# EAGLE design brushless (EAGLE 6.1)

## Sheet 1 of 4
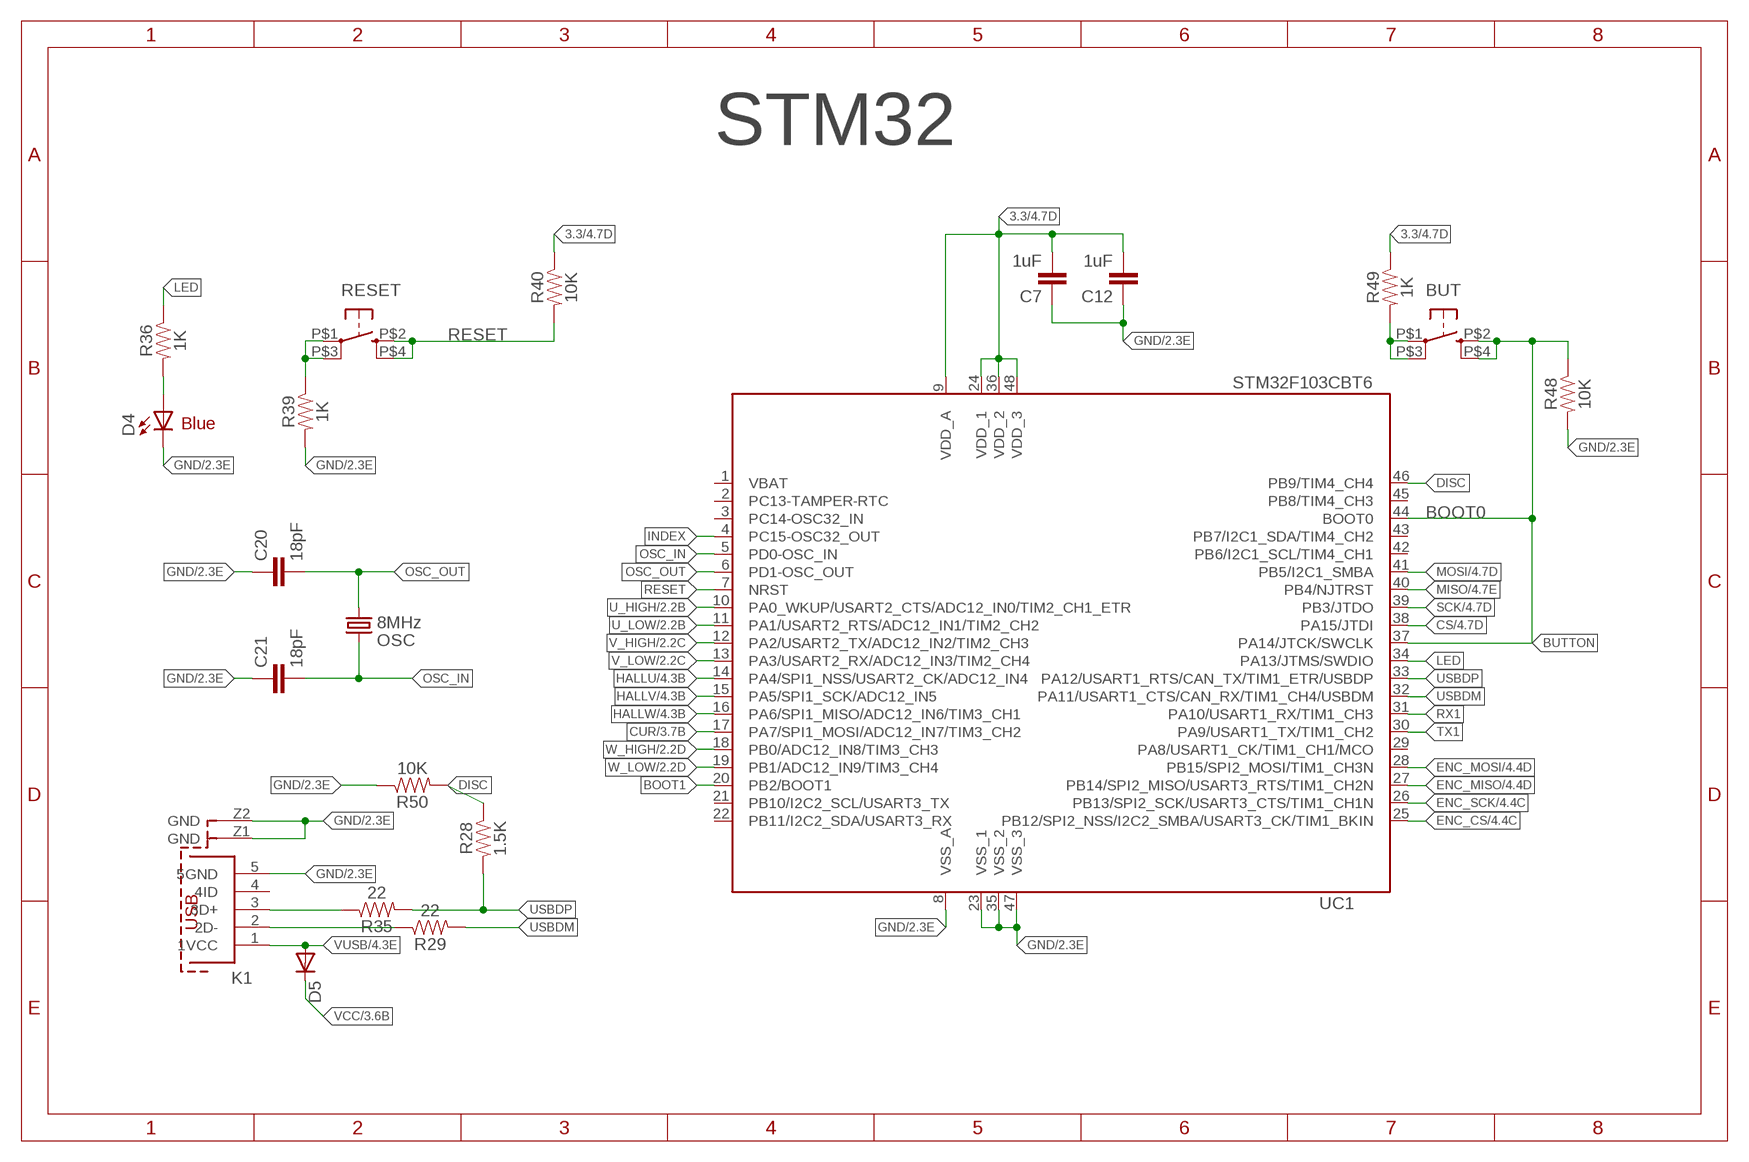
[diagram p0: schematic, sheet 1]

### Parts
BUT  KMR211GLFS  BUTTON-KMR241GLFS  [PUSHBUTTON-KMR241GLFS]
C7  1uF  CAP0805  [0805@1]
C12  1uF  CAP0805  [0805@1]
C20  18pF  CAP0805  [0805@1]
C21  18pF  CAP0805  [0805@1]
D4  Blue  LED1206  [LED-1206]
D5  DIODESOD  [SOD-323]
K1  614105150721  [614105150721]
OSC  8MHz  CRYSTAL5X3  [CRYSTAL-SMD-5X3]
R28  1.5K  RESISTOR0805  [0805]
R29  22  RESISTOR0805  [0805]
R35  22  RESISTOR0805  [0805]
R36  1K  RESISTOR0805  [0805]
R39  1K  RESISTOR0805  [0805]
R40  10K  RESISTOR0805  [0805]
R48  10K  RESISTOR0805  [0805]
R49  1K  RESISTOR0805  [0805]
R50  10K  RESISTOR0805  [0805]
RESET  KMR211GLFS  BUTTON-KMR241GLFS  [PUSHBUTTON-KMR241GLFS]
UC1  STM32F103CBT6  STM32_STM32F103CB  [STM32_LQFP48]

### Nets
3.3: C7.2 C12.2 R40.1 R49.1 UC1.9(VDD_A) UC1.24(VDD_1) UC1.36(VDD_2) UC1.48(VDD_3) ; also sheet 4
BOOT1: UC1.20(PB2/BOOT1)
BUTTON: BUT.P$2 BUT.P$4 R48.1 UC1.37(PA14/JTCK/SWCLK) UC1.44(BOOT0)
CS: UC1.38(PA15/JTDI) ; also sheet 4
CUR: UC1.17(PA7/SPI1_MOSI/ADC12_IN7/TIM3_CH2) ; also sheet 3
DISC: R28.1 R50.2 UC1.46(PB9/TIM4_CH4)
ENC_CS: UC1.25(PB12/SPI2_NSS/I2C2_SMBA/USART3_CK/TIM1_BKIN) ; also sheet 4
ENC_MISO: UC1.27(PB14/SPI2_MISO/USART3_RTS/TIM1_CH2N) ; also sheet 4
ENC_MOSI: UC1.28(PB15/SPI2_MOSI/TIM1_CH3N) ; also sheet 4
ENC_SCK: UC1.26(PB13/SPI2_SCK/USART3_CTS/TIM1_CH1N) ; also sheet 4
GND [power]: C7.1 C12.1 C20.1 C21.1 D4.C K1.5(5GND) K1.Z1(GND) K1.Z2(GND) R39.2 R48.2 R50.1 UC1.8(VSS_A) UC1.23(VSS_1) UC1.35(VSS_2) UC1.47(VSS_3) ; also sheet 2,3,4
HALLU: UC1.14(PA4/SPI1_NSS/USART2_CK/ADC12_IN4) ; also sheet 4
HALLV: UC1.15(PA5/SPI1_SCK/ADC12_IN5) ; also sheet 4
HALLW: UC1.16(PA6/SPI1_MISO/ADC12_IN6/TIM3_CH1) ; also sheet 4
INDEX: UC1.4(PC15-OSC32_OUT)
LED: R36.1 UC1.34(PA13/JTMS/SWDIO)
MISO: UC1.40(PB4/NJTRST) ; also sheet 4
MOSI: UC1.41(PB5/I2C1_SMBA) ; also sheet 4
N$19: R39.1 RESET.P$1 RESET.P$3
N$26: BUT.P$1 BUT.P$3 R49.2
N$29: D4.A R36.2
N$59: K1.2(2D-) R29.1
N$60: K1.3(3D+) R35.1
OSC_IN: C21.2 OSC.3 UC1.5(PD0-OSC_IN)
OSC_OUT: C20.2 OSC.1 UC1.6(PD1-OSC_OUT)
RESET: R40.2 RESET.P$2 RESET.P$4 UC1.7(NRST)
RX1: UC1.31(PA10/USART1_RX/TIM1_CH3)
SCK: UC1.39(PB3/JTDO) ; also sheet 4
TX1: UC1.30(PA9/USART1_TX/TIM1_CH2)
U_HIGH: UC1.10(PA0_WKUP/USART2_CTS/ADC12_IN0/TIM2_CH1_ETR) ; also sheet 2
U_LOW: UC1.11(PA1/USART2_RTS/ADC12_IN1/TIM2_CH2) ; also sheet 2
USBDM: R29.2 UC1.32(PA11/USART1_CTS/CAN_RX/TIM1_CH4/USBDM)
USBDP: R28.2 R35.2 UC1.33(PA12/USART1_RTS/CAN_TX/TIM1_ETR/USBDP)
V_HIGH: UC1.12(PA2/USART2_TX/ADC12_IN2/TIM2_CH3) ; also sheet 2
V_LOW: UC1.13(PA3/USART2_RX/ADC12_IN3/TIM2_CH4) ; also sheet 2
VCC: D5.1(C) ; also sheet 3,4
VUSB: D5.2(A) K1.1(1VCC) ; also sheet 4
W_HIGH: UC1.18(PB0/ADC12_IN8/TIM3_CH3) ; also sheet 2
W_LOW: UC1.19(PB1/ADC12_IN9/TIM3_CH4) ; also sheet 2
Unconnected: K1.4(4ID) UC1.2(PC13-TAMPER-RTC) UC1.3(PC14-OSC32_IN) UC1.21(PB10/I2C2_SCL/USART3_TX) UC1.22(PB11/I2C2_SDA/USART3_RX) UC1.29(PA8/USART1_CK/TIM1_CH1/MCO) UC1.42(PB6/I2C1_SCL/TIM4_CH1) UC1.43(PB7/I2C1_SDA/TIM4_CH2) UC1.45(PB8/TIM4_CH3)

### Notes on the sheet
- STM32
- Blue
- BOOT0

## Sheet 2 of 4
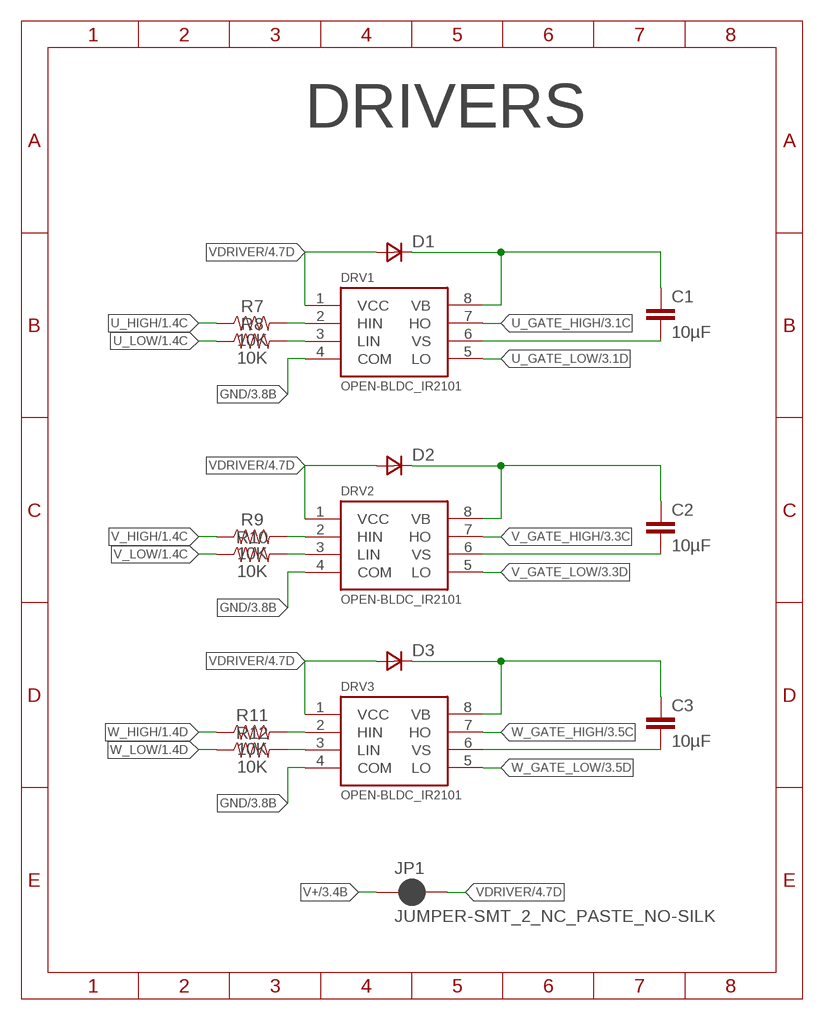
[diagram p1: schematic, sheet 2]

### Parts
C1  10µF  0.33UF/330NF-0805-50V-10%  [0805]
C2  10µF  0.33UF/330NF-0805-50V-10%  [0805]
C3  10µF  0.33UF/330NF-0805-50V-10%  [0805]
D1  ZETEX_VAR2SOT23  [ZETEX_SOT-23]
D2  ZETEX_VAR2SOT23  [ZETEX_SOT-23]
D3  ZETEX_VAR2SOT23  [ZETEX_SOT-23]
DRV1  OPEN-BLDC_IR2101  [OPEN-BLDC_SO-8]
DRV2  OPEN-BLDC_IR2101  [OPEN-BLDC_SO-8]
DRV3  OPEN-BLDC_IR2101  [OPEN-BLDC_SO-8]
JP1  JUMPER-SMT_2_NC_PASTE_NO-SILK  [SMT-JUMPER_2_NC_PASTE_NO-SILK]
R7  10K  RESISTOR0805  [0805]
R8  10K  RESISTOR0805  [0805]
R9  10K  RESISTOR0805  [0805]
R10  10K  RESISTOR0805  [0805]
R11  10K  RESISTOR0805  [0805]
R12  10K  RESISTOR0805  [0805]

### Nets
GND [power]: DRV1.4(COM) DRV2.4(COM) DRV3.4(COM) ; also sheet 1,3,4
N$4: DRV1.2(HIN) R7.2
N$5: C1.1 D1.1(C) DRV1.8(VB)
N$8: DRV1.3(LIN) R8.2
N$10: C2.1 D2.1(C) DRV2.8(VB)
N$11: C1.2 DRV1.6(VS)
N$12: DRV2.2(HIN) R9.2
N$13: DRV2.3(LIN) R10.2
N$14: C2.2 DRV2.6(VS)
N$15: C3.1 D3.1(C) DRV3.8(VB)
N$16: DRV3.2(HIN) R11.2
N$17: DRV3.3(LIN) R12.2
N$18: C3.2 DRV3.6(VS)
U_GATE_HIGH: DRV1.7(HO) ; also sheet 3
U_GATE_LOW: DRV1.5(LO) ; also sheet 3
U_HIGH: R7.1 ; also sheet 1
U_LOW: R8.1 ; also sheet 1
V+ [vdriver]: JP1.1 ; also sheet 3,4
V_GATE_HIGH: DRV2.7(HO) ; also sheet 3
V_GATE_LOW: DRV2.5(LO) ; also sheet 3
V_HIGH: R9.1 ; also sheet 1
V_LOW: R10.1 ; also sheet 1
VDRIVER [vdriver]: D1.3(A) D2.3(A) D3.3(A) DRV1.1(VCC) DRV2.1(VCC) DRV3.1(VCC) JP1.2 ; also sheet 4
W_GATE_HIGH: DRV3.7(HO) ; also sheet 3
W_GATE_LOW: DRV3.5(LO) ; also sheet 3
W_HIGH: R11.1 ; also sheet 1
W_LOW: R12.1 ; also sheet 1

### Notes on the sheet
- DRIVERS

## Sheet 3 of 4
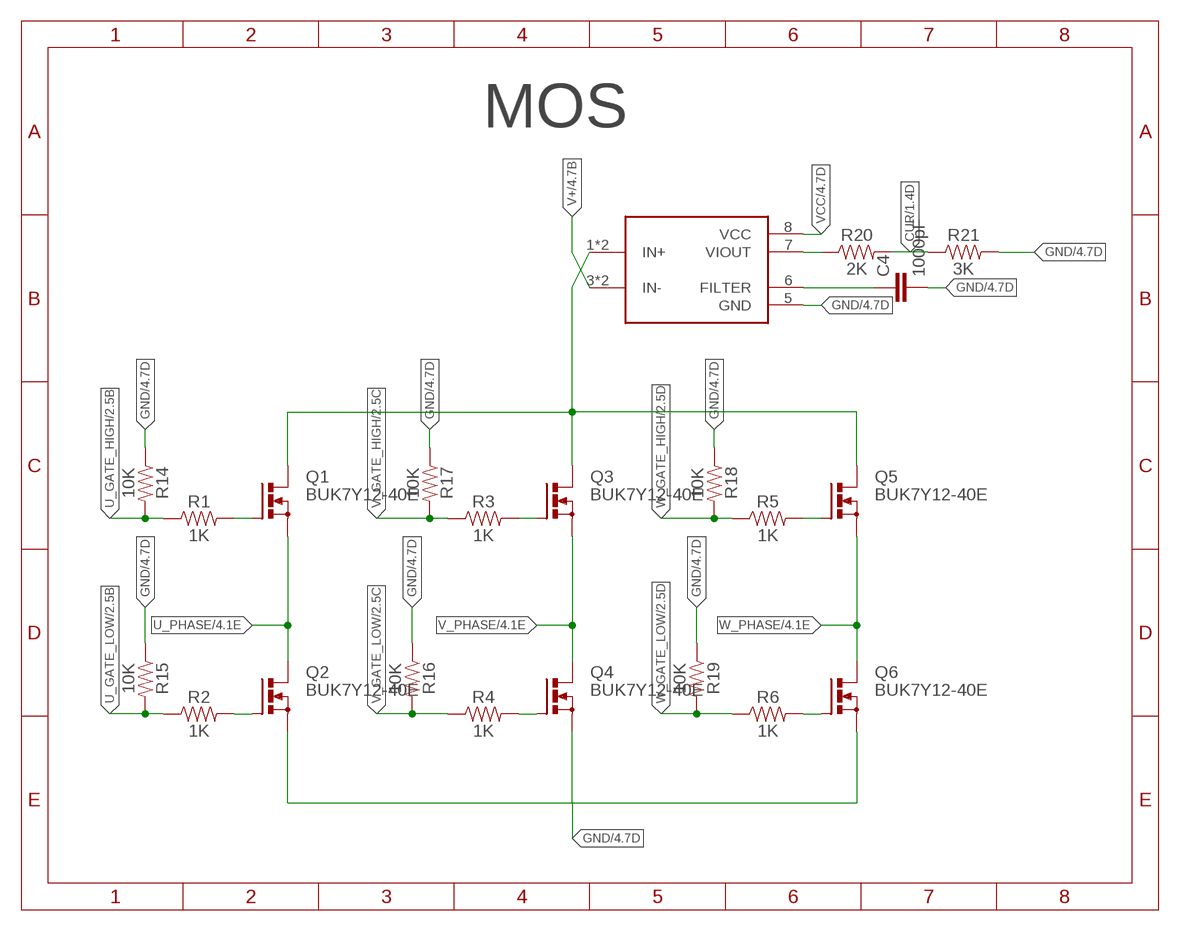
[diagram p2: schematic, sheet 3]

### Parts
C4  1000pF  CAP0805  [0805@1]
Q1  BUK7Y12-40E  [SOT669]
Q2  BUK7Y12-40E  [SOT669]
Q3  BUK7Y12-40E  [SOT669]
Q4  BUK7Y12-40E  [SOT669]
Q5  BUK7Y12-40E  [SOT669]
Q6  BUK7Y12-40E  [SOT669]
R1  1K  RESISTOR0805  [0805]
R2  1K  RESISTOR0805  [0805]
R3  1K  RESISTOR0805  [0805]
R4  1K  RESISTOR0805  [0805]
R5  1K  RESISTOR0805  [0805]
R6  1K  RESISTOR0805  [0805]
R14  10K  RESISTOR0805  [0805]
R15  10K  RESISTOR0805  [0805]
R16  10K  RESISTOR0805  [0805]
R17  10K  RESISTOR0805  [0805]
R18  10K  RESISTOR0805  [0805]
R19  10K  RESISTOR0805  [0805]
R20  2K  RESISTOR0805  [0805]
R21  3K  RESISTOR0805  [0805]
SENSE  ACS712  [SO8]

### Nets
CUR: R20.2 R21.1 ; also sheet 1
GND [power]: C4.2 Q2.1(S) Q2.2(S) Q2.3(S) Q4.1(S) Q4.2(S) Q4.3(S) Q6.1(S) Q6.2(S) Q6.3(S) R14.1 R15.1 R16.1 R17.1 R18.1 R19.1 R21.2 SENSE.5(GND) ; also sheet 1,2,4
N$1: Q1.4(G) R1.2
N$2: Q3.4(G) R3.2
N$3: Q2.4(G) R2.2
N$6: Q4.4(G) R4.2
N$7: Q5.4(G) R5.2
N$9: Q6.4(G) R6.2
N$24: R20.1 SENSE.7(VIOUT)
N$27: C4.1 SENSE.6(FILTER)
U_GATE_HIGH: R1.1 R14.2 ; also sheet 2
U_GATE_LOW: R2.1 R15.2 ; also sheet 2
U_PHASE [power]: Q1.1(S) Q1.2(S) Q1.3(S) Q2.MB(D) ; also sheet 4
V+ [vdriver]: SENSE.3(IN-) SENSE.4(IN-) ; also sheet 2,4
V+_MOS [power]: Q1.MB(D) Q3.MB(D) Q5.MB(D) SENSE.1(IN+) SENSE.2(IN+)
V_GATE_HIGH: R3.1 R17.2 ; also sheet 2
V_GATE_LOW: R4.1 R16.2 ; also sheet 2
V_PHASE [power]: Q3.1(S) Q3.2(S) Q3.3(S) Q4.MB(D) ; also sheet 4
VCC: SENSE.8(VCC) ; also sheet 1,4
W_GATE_HIGH: R5.1 R18.2 ; also sheet 2
W_GATE_LOW: R6.1 R19.2 ; also sheet 2
W_PHASE [power]: Q5.1(S) Q5.2(S) Q5.3(S) Q6.MB(D) ; also sheet 4

### Notes on the sheet
- MOS

## Sheet 4 of 4
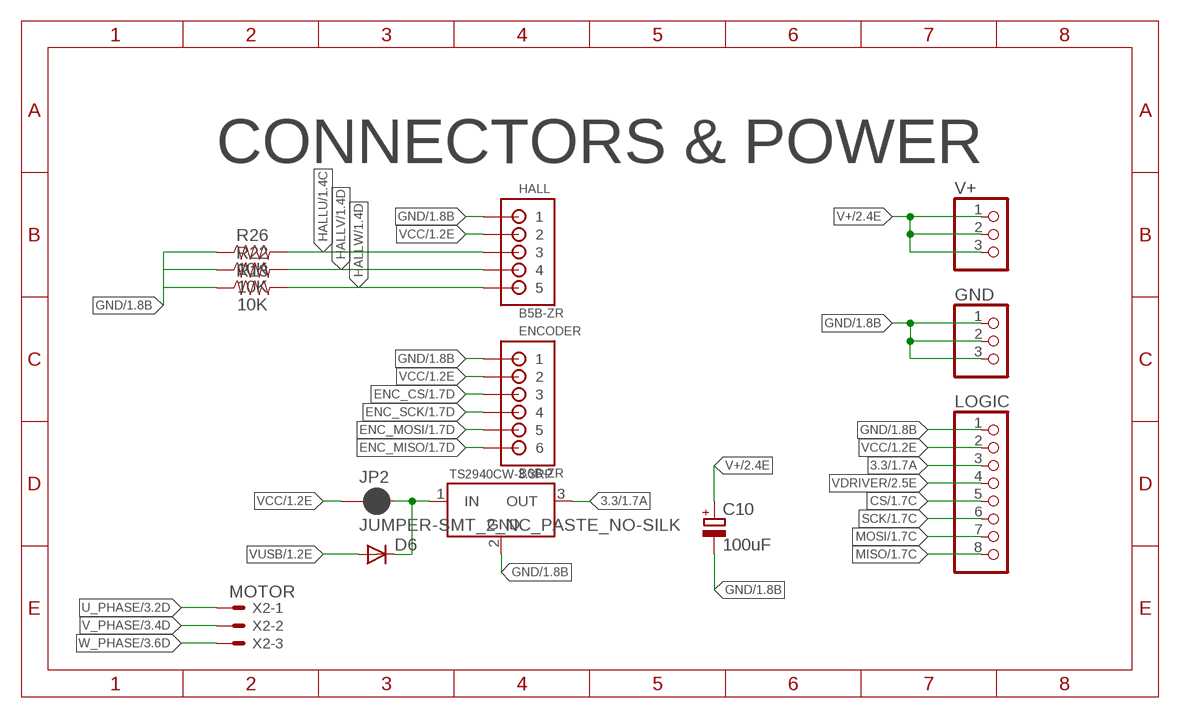
[diagram p3: schematic, sheet 4]

### Parts
C10  100uF  CPOL_EU_3.5-8  [E3,5-8]
D6  DIODESOD  [SOD-323]
ENCODER  B6B-ZR  [B6B-ZR]
GND  CONNEC_1X03  [CONNEC_1X03]
HALL  B5B-ZR  [B5B-ZR]
JP2  JUMPER-SMT_2_NC_PASTE_NO-SILK  [SMT-JUMPER_2_NC_PASTE_NO-SILK]
LOGIC  CONNEC_1X08  [CONNEC_1X08]
R13  10K  RESISTOR0805  [0805]
R22  10K  RESISTOR0805  [0805]
R26  10K  RESISTOR0805  [0805]
REG1  TS2940CW-3.3RP  [SOT223]
V+  CONNEC_1X03  [CONNEC_1X03]
X2  MOTOR  JST-XH-03-PIN-LONG-PAD  [JST-XH-03-PACKAGE-LONG-PAD]

### Nets
3.3: LOGIC.3 REG1.3(OUT) ; also sheet 1
CS: LOGIC.5 ; also sheet 1
ENC_CS: ENCODER.3 ; also sheet 1
ENC_MISO: ENCODER.6 ; also sheet 1
ENC_MOSI: ENCODER.5 ; also sheet 1
ENC_SCK: ENCODER.4 ; also sheet 1
GND [power]: C10.- ENCODER.1 GND.1 GND.2 GND.3 HALL.1 LOGIC.1 R13.1 R22.1 R26.1 REG1.2(GND) ; also sheet 1,2,3
HALLU: HALL.3 R26.2 ; also sheet 1
HALLV: HALL.4 R22.2 ; also sheet 1
HALLW: HALL.5 R13.2 ; also sheet 1
MISO: LOGIC.8 ; also sheet 1
MOSI: LOGIC.7 ; also sheet 1
N$22: D6.1(C) JP2.2 REG1.1(IN)
SCK: LOGIC.6 ; also sheet 1
U_PHASE [power]: X2.1 ; also sheet 3
V+ [vdriver]: C10.+ V+.1 V+.2 V+.3 ; also sheet 2,3
V_PHASE [power]: X2.2 ; also sheet 3
VCC: ENCODER.2 HALL.2 JP2.1 LOGIC.2 ; also sheet 1,3
VDRIVER [vdriver]: LOGIC.4 ; also sheet 2
VUSB: D6.2(A) ; also sheet 1
W_PHASE [power]: X2.3 ; also sheet 3

### Notes on the sheet
- CONNECTORS & POWER

## Power pins joined to a net without a drawn wire
VBAT: UC1.1(VBAT)

## Library data of the parts
BUT RESET = okie:BUTTON-KMR241GLFS; FARNELL: 1437637
C1-C3 = SparkFun-Capacitors:0.33UF/330NF: 0.33µF/330nF ceramic capacitors A capacitor is a passive two-terminal electrical component used to store electrical energy temporarily in an electric field.; FARNELL: 2528772; PROD_ID: CAP-08469; VALUE: 0.33µF
C4 = SparkFun-Passives:CAP: Capacitor Standard 0603 ceramic capacitor, and 0.1" leaded capacitor.; FARNELL: 2496935
C7 C12 = SparkFun-Passives:CAP: Capacitor Standard 0603 ceramic capacitor, and 0.1" leaded capacitor.; FARNELL: 2496946
C10 = rhoban:CPOL_EU: 47uF: http://fr.farnell.com/panasonic-electronic-components/eee1ca470sp/condensateur-elec-alu-47uf-16v/dp/9696946 220uF: http://fr.farnell.com/panasonic-electronic-components/eeefk1c221xp/condensateur-elec-alu-220uf-16v/dp/1850103; FARNELL: 1144713
C20 C21 = SparkFun-Passives:CAP: Capacitor Standard 0603 ceramic capacitor, and 0.1" leaded capacitor.; FARNELL: 1414620
D1-D3 = rhoban:ZETEX_VAR2SOT23: DIODE; FARNELL: 2317446
D4 = SparkFun:LED: LEDs Standard schematic elements and footprints for 5mm, 3mm, 1206, and 0603 sized LEDs. 5mm - Spark Fun Electronics SKU : COM-00529 (and others); FARNELL: 1581233
D5 D6 = SparkFun-DiscreteSemi:DIODE: Diode These are standard reverse protection diodes and small signal diodes. SMA package can handle up to about 1A. SOD-323 can handle about 200mA. What the SOD-323 package when ordering, there are some mfgs out there that are 5-pin packages.; FARNELL: 8737843RL
DRV1-DRV3 = rhoban:OPEN-BLDC_IR2101; FARNELL: 2296000
ENCODER = jst:B6B-ZR: JST-ZH Connector 6 pol, 1.5mm pitch Package: B6B-ZR Source: http://www.jst-mfg.com/product/pdf/eng/eZH.pdf
GND V+ = rhoban:CONNEC_1X03; FARNELL: 1022248
HALL = jst:B5B-ZR: JST-ZH Connector 5 pol, 1.5mm pitch Package: B5B-ZR Source: http://www.jst-mfg.com/product/pdf/eng/eZH.pdf
JP1 JP2 = SparkFun-Jumpers:JUMPER-SMT_2_NC_PASTE: Normally closed solder jumper This jumper has an aperture in the stencil to allow solder paste to bridge the split in the wire so it's normally closed (NC). Wick off the solder to open the connection. Reapply solder to reclose the connection.; FARNELL: -
K1 = rhoban:614105150721: WR-COM_USB_Micro Type B_Vertical_THT; Micro Type B Vertical THT- Tape & Reel not for Pick & Place machine Code : Con_I-O_COM_USB_2.0_B_614105150721_614105150721 <http://katalog.we-online.de/media/images/eican/Con_I-O_COM_USB_2.0_B_614105150721_pf2.jpg> Details see: http://katalog.we-online.de/em/datasheet/614105150721.pdf Created 12/08/2014, Dan Xu 2014 (C) Wurth Elektronik
LOGIC = rhoban:CONNEC_1X08; FARNELL: 1022256
OSC = SparkFun2:CRYSTAL: Crystals Various standard crystals. Proven footprints. Spark Fun Electronics SKU : COM-00534; FARNELL: 2467818
Q1-Q6 = transistor-power:BUK7Y12-40E; FARNELL: 2319916
R1-R6 R36 R39 R49 = SparkFun-Resistors:RESISTOR: Generic Resistor Package; FARNELL: 2446904
R7-R19 R22 R26 R40 R48 R50 = SparkFun-Resistors:RESISTOR: Generic Resistor Package; FARNELL: 2447553
R20 = SparkFun-Resistors:RESISTOR: Generic Resistor Package; FARNELL: 2446939
R21 = SparkFun-Resistors:RESISTOR: Generic Resistor Package; FARNELL: 2446965
R28 = SparkFun-Resistors:RESISTOR: Generic Resistor Package; FARNELL: 2446909
R29 R35 = SparkFun-Resistors:RESISTOR: Generic Resistor Package; FARNELL: 2446926
REG1 = rhoban:TS2940CW-3.3RP; FARNELL: 7261403
SENSE = rhoban:ACS712; FARNELL: 1329624
UC1 = rhoban:STM32_STM32F103CB; FARNELL: 1606327
X2 = Rembrandt Electronics - JST XH Connectors v1-0:JST-XH-03-PIN: JST XH Connector 2 Pin Wire to board connector. Pitch: 2,54 mm, (0.100") Number of pins: 3 Created by Rembrandt Electronics www.rembrandtelectronics.com

## Net classes
1 vdriver: width 0.254 mm

## Board
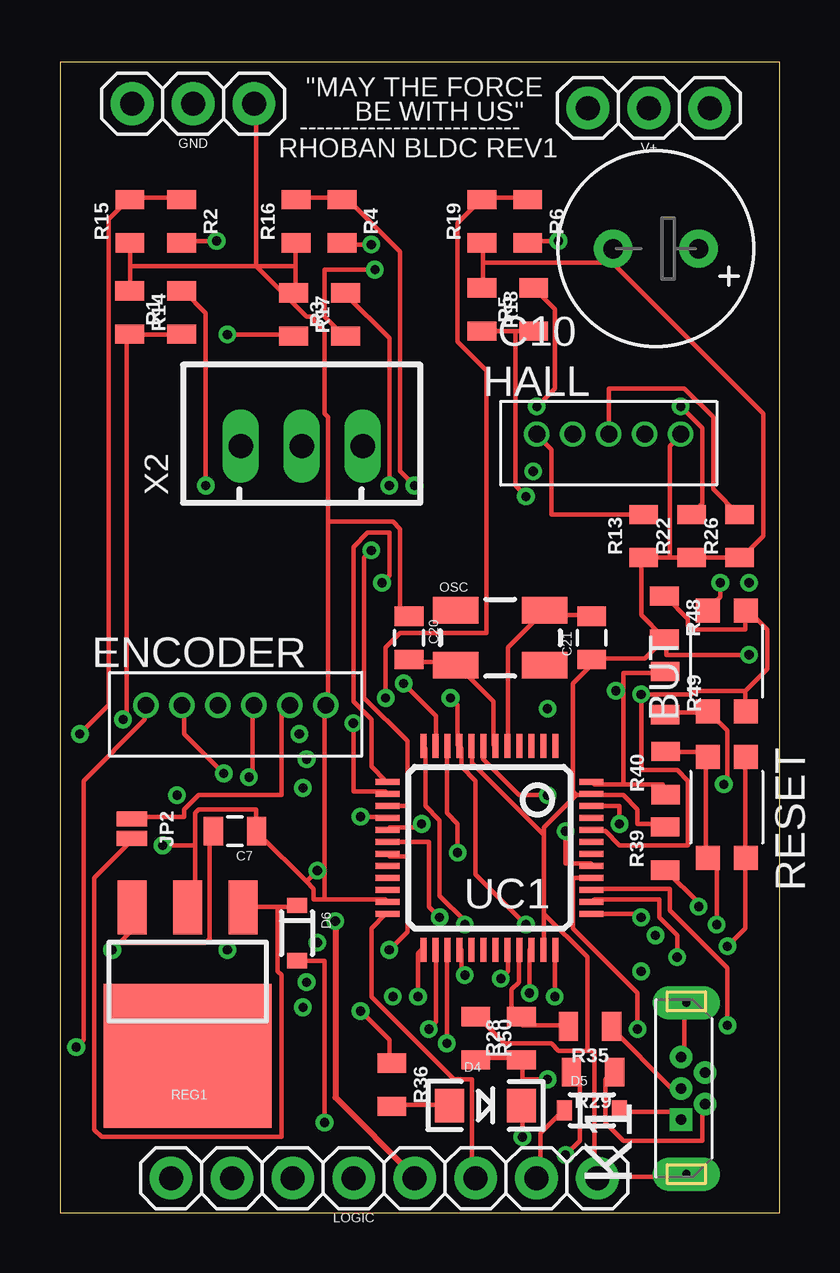
[diagram p4: board, top side]
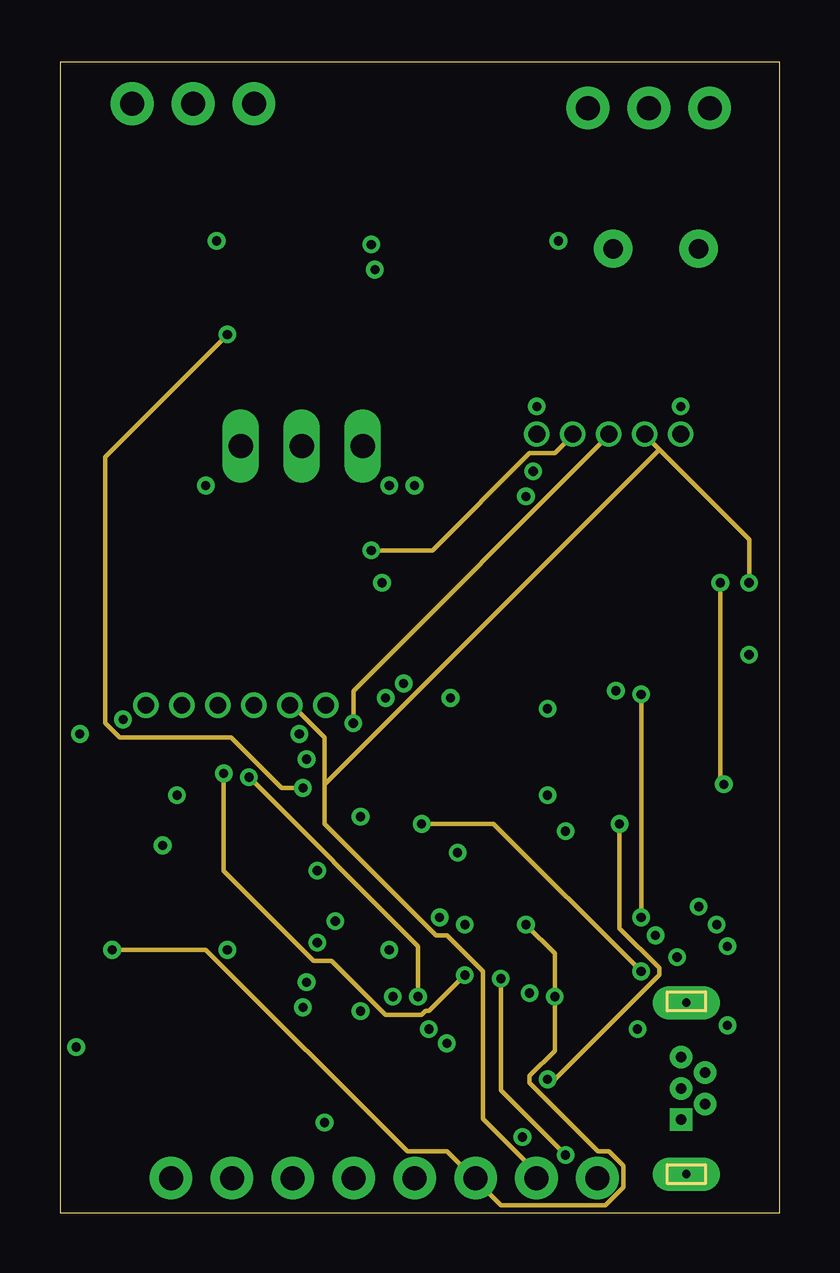
[diagram p5: board, inner layer Route2]
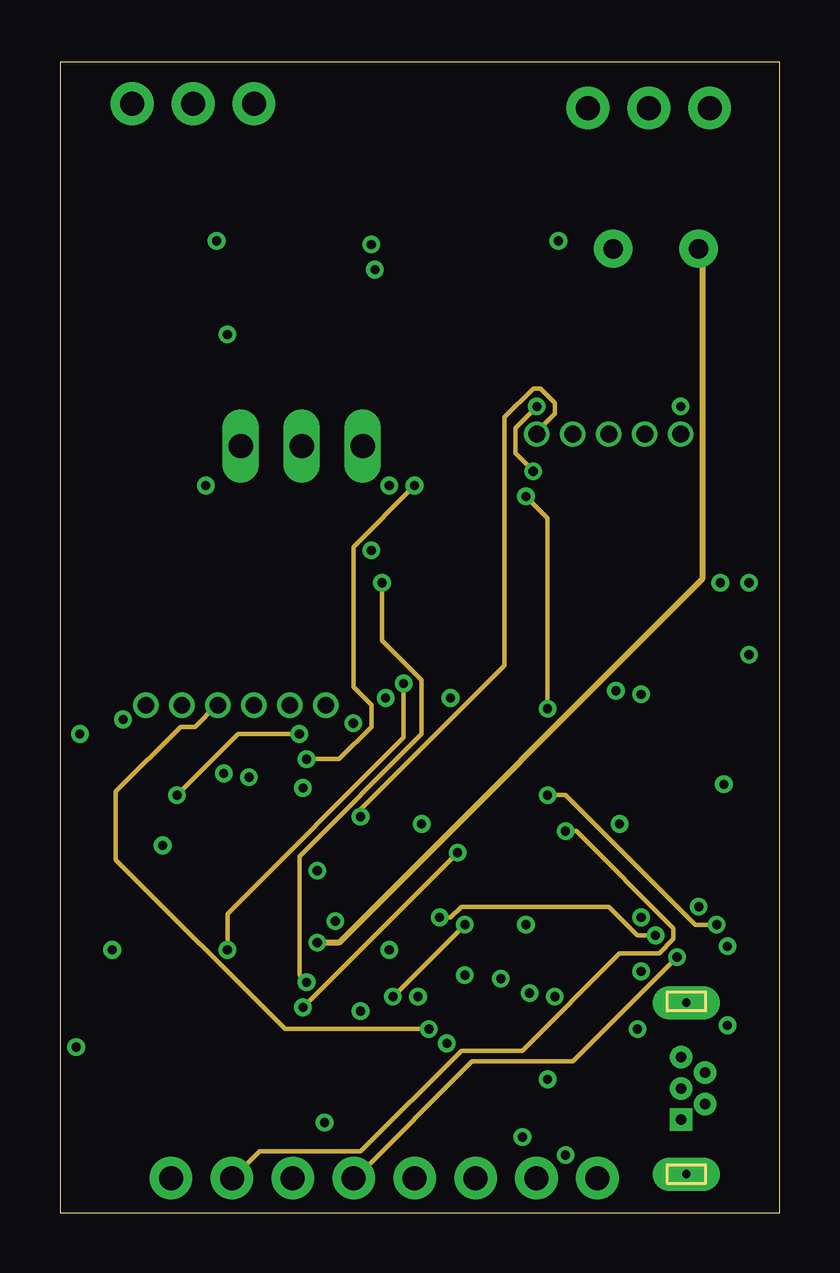
[diagram p6: board, inner layer Route15]
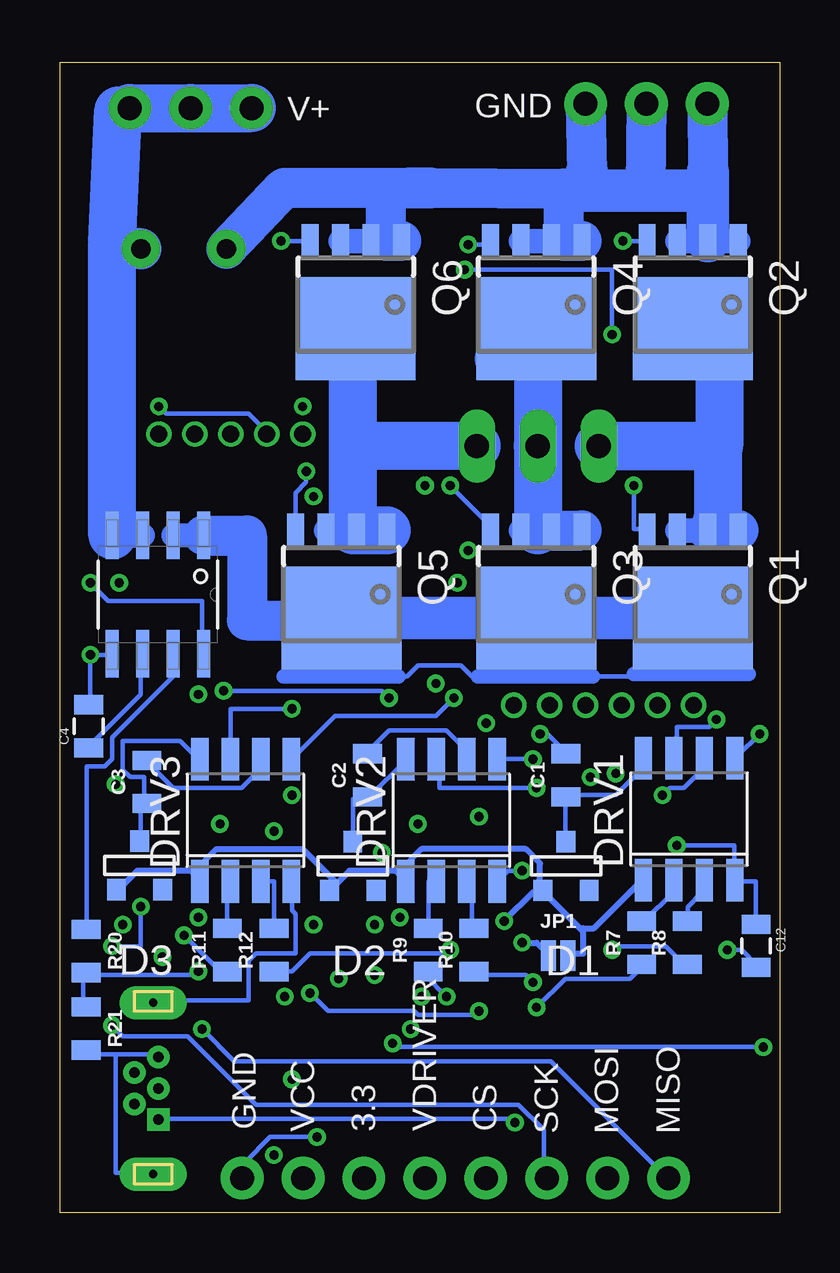
[diagram p7: board, bottom side, seen from below]

Size 30 x 47.97 mm. Coordinates in mm from the lower left corner, seen from the top.
Outline: 0,0 30,0 30,47.97 0,47.97 0,0
Copper layers (1*2*15*16): Top 0.035559375mm / dielectric 0.47751875mm / Route2 0.035559375mm / dielectric 0.47751875mm / Route15 0.035559375mm / dielectric 0.47751875mm / Bottom 0.035559375mm
Design rules: minimum track width 7mil, minimum drill 15mil, track to track 7mil, track to pad 7mil, pad to pad 7mil, via to via 7mil, smd to smd 7mil, copper to edge 7mil, drill to drill 7mil, minimum pad ring 7mil, minimum via ring 7mil, stop-mask expansion 4mil, vias tented up to drill 25mil, thermal gap 10mil

### Footprints (pad centres in the part's own frame; a part is rotated, then mirrored left to right if it is on the bottom)
PUSHBUTTON-KMR241GLFS = smd 1 x 1: P$1 2.1,0.8; P$2 2.1,-0.8; P$3 -2.1,0.8; P$4 -2.1,-0.8
0805 = smd 0.8 x 1.2: 1 -0.9,0; 2 0.9,0
0805@1 = smd 0.8 x 1.2: 1 -0.9,0; 2 0.9,0
E3,5-8 = drill 0.813 pad 1.6: + -1.778,0; - 1.778,0
ZETEX_SOT-23 = smd 0.787 x 0.889: 1 0.025,-1.016; 2 -0.94,1.016; 3 0.991,1.016
LED-1206 = smd 1.2 x 1.4: A -1.5,0; C 1.5,0
SOD-323 = smd 0.63 x 0.83: 1 -1.15,0; 2 1.15,0
OPEN-BLDC_SO-8 = smd 0.72 x 1.78: 1 -1.905,-2.543; 2 -0.635,-2.543; 3 0.635,-2.543; 4 1.905,-2.543; 5 1.905,2.543; 6 0.635,2.543; 7 -0.635,2.543; 8 -1.905,2.543
B6B-ZR = drill 0.7: 1 9,-1.3; 2 7.5,-1.3; 3 6,-1.3; 4 4.5,-1.3; 5 3,-1.3; 6 1.5,-1.3
CONNEC_1X03 = drill 1 pad 1.778: 1 -1.27,1.27; 2 1.27,1.27; 3 3.81,1.27
B5B-ZR = drill 0.7: 1 7.5,-1.3; 2 6,-1.3; 3 4.5,-1.3; 4 3,-1.3; 5 1.5,-1.3
SMT-JUMPER_2_NC_PASTE_NO-SILK = smd 0.635 x 1.27: 1 -0.406,0; 2 0.406,0
614105150721 = drill 0.44 pad 0.94 square: 1 2.275,0.22 | drill 0.44 pad 0.94: 2 2.925,-0.78; 3 3.575,0.22; 4 4.225,-0.78; 5 4.875,0.22 | drill 0.35 pad 1.4 long: Z1 0,0; Z2 7.15,0
CONNEC_1X08 = drill 1 pad 1.778: 1 -10.16,0; 2 -7.62,0; 3 -5.08,0; 4 -2.54,0; 5 0,0; 6 2.54,0; 7 5.08,0; 8 7.62,0
CRYSTAL-SMD-5X3 = smd 1.9 x 1.1: 1 -1.85,-1.15; 2 1.85,-1.15; 3 1.85,1.15; 4 -1.85,1.15
SOT669 = smd 0.7 x 1.4: 1 -1.905,-2.65; 2 -0.635,-2.65; 3 0.635,-2.65; 4 1.905,-2.65 | smd 5 x 4.3: MB 0,1
SOT223 = smd 1.219 x 2.235: 1 -2.311,-3.099; 2 0,-3.099; 3 2.311,-3.099 | smd 7 x 6: 4 0,3.099
SO8 = smd 1.981 x 0.533: 1 -2.464,1.905; 2 -2.464,0.635; 3 -2.464,-0.635; 4 -2.464,-1.905; 5 2.464,-1.905; 6 2.464,-0.635; 7 2.464,0.635; 8 2.464,1.905
STM32_LQFP48 = smd 0.25 x 1: 1 -2.75,-4.25; 2 -2.25,-4.25; 3 -1.75,-4.25; 4 -1.25,-4.25; 5 -0.75,-4.25; 6 -0.25,-4.25; 7 0.25,-4.25; 8 0.75,-4.25; 9 1.25,-4.25; 10 1.75,-4.25; 11 2.25,-4.25; 12 2.75,-4.25; 25 2.75,4.25; 26 2.25,4.25; 27 1.75,4.25; 28 1.25,4.25; 29 0.75,4.25; 30 0.25,4.25; 31 -0.25,4.25; 32 -0.75,4.25; 33 -1.25,4.25; 34 -1.75,4.25; 35 -2.25,4.25; 36 -2.75,4.25 | smd 1 x 0.25: 13 4.25,-2.75; 14 4.25,-2.25; 15 4.25,-1.75; 16 4.25,-1.25; 17 4.25,-0.75; 18 4.25,-0.25; 19 4.25,0.25; 20 4.25,0.75; 21 4.25,1.25; 22 4.25,1.75; 23 4.25,2.25; 24 4.25,2.75; 37 -4.25,2.75; 38 -4.25,2.25; 39 -4.25,1.75; 40 -4.25,1.25; 41 -4.25,0.75; 42 -4.25,0.25; 43 -4.25,-0.25; 44 -4.25,-0.75; 45 -4.25,-1.25; 46 -4.25,-1.75; 47 -4.25,-2.25; 48 -4.25,-2.75
JST-XH-03-PACKAGE-LONG-PAD = drill 1.016 long: 1 -2.54,0; 2 0,0; 3 2.54,0

### Placement (x,y rotation side)
BUT  27.8,23 90 top
C1  8.9,18.25 90 bottom
C2  17.18,18.25 90 bottom
C3  26.38,17.97 90 bottom
C4  28.8,20.28 90 bottom
C7  1uF  [0805]  7.29,15.91 180 top
C10  24.84,40.19 180 top
C12  1uF  [0805]  0.98,11.14 270 bottom
C20  18pF  [0805]  14.55,23.98 270 top
C21  18pF  [0805]  22.17,23.98 90 top
D1  8.88,14.46 180 bottom
D2  17.77,14.46 180 bottom
D3  26.66,14.49 180 bottom
D4  17.74,4.48 0 top
D5  22.18,4.29 0 top
D6  9.88,11.67 270 top
DRV1  3.77,16.42 0 bottom
DRV2  13.68,16.37 0 bottom
DRV3  22.26,16.37 0 bottom
ENCODER  2.08,22.47 0 top
GND  6.82,47.51 180 top
HALL  18.38,33.77 0 top
JP1  9.22,10.73 0 bottom
JP2  2.99,16.02 270 top
K1  26.11,1.62 90 top
LOGIC  12.25,1.46 180 top
OSC  18.36,23.98 0 top
Q1  3.62,25.8 180 bottom
Q2  3.62,37.86 180 bottom
Q3  10.14,25.8 180 bottom
Q4  10.14,37.86 180 bottom
Q5  18.27,25.8 180 bottom
Q6  17.67,37.86 180 bottom
R1  5.07,37.53 90 top
R2  5.07,41.33 270 top
R3  11.9,37.46 90 top
R4  11.75,41.33 270 top
R5  19.75,37.66 90 top
R6  19.5,41.33 270 top
R7  5.75,11.26 90 bottom
R8  3.85,11.26 90 bottom
R9  14.64,10.96 90 bottom
R10  12.74,10.96 90 bottom
R11  23.02,10.96 90 bottom
R12  21.07,10.96 90 bottom
R13  24.33,28.22 90 top
R14  2.91,37.53 270 top
R15  2.92,41.33 90 top
R16  9.85,41.33 90 top
R17  9.74,37.46 270 top
R18  17.59,37.66 270 top
R19  17.6,41.33 90 top
R20  28.91,10.92 270 bottom
R21  28.91,7.69 270 bottom
R22  26.33,28.22 90 top
R26  28.33,28.22 90 top
R28  19.24,7.29 90 top
R29  22.22,5.87 180 top
R35  22.1,7.78 180 top
R36  13.84,5.35 270 top
R39  25.23,15.19 90 top
R40  25.25,18.34 90 top
R48  25.2,24.81 270 top
R49  25.23,21.67 270 top
R50  17.34,7.29 270 top
REG1  5.33,9.64 180 top
RESET  27.8,16.91 270 top
SENSE  25.91,25.78 270 bottom
UC1  17.9,15.22 180 top
V+  25.82,47.33 180 top
X2  10.08,31.97 0 top

### Tracks (layer width: path | path; a pad name or v marks a point on that pad's centre or on a via)
3.3  (via drill 0.38)
  Top 0.178: 23.48,17.87 25.13,17.87 25.13,17.57 R40.1 | 23.48,17.87 22.28,17.87 UC1.48 | 23.48,17.87 23.48,21.77 | 23.48,21.77 23.48,22.52 25.13,22.52 R49.1 | v20.63,9.02 20.63,10.97 UC1.36 | v19.43,12.02 17.33,14.12 17.33,18.02 16.73,18.62 16.73,19.37 UC1.9 16.58,19.52 16.58,21.17 v16.28,21.47 | v23.18,21.77 23.48,21.77 | 2.48,11.27 2.93,11.72 2.93,12.62 REG1.3 | 2.48,11.27 v2.18,10.97 | 2.48,11.27 6.08,11.27 6.23,11.42 6.23,15.62 6.38,15.77 C7.2 | UC1.24 13.58,12.47 12.98,11.87 12.98,9.02 16.43,5.57 17.18,5.57 17.18,1.52 LOGIC.3
  Route2 0.178: v19.43,12.02 20.63,10.82 v20.63,9.02 20.63,6.77 19.58,5.72 19.58,5.42 22.43,2.57 22.88,2.57 23.48,1.97 23.48,1.07 22.73,0.32 18.38,0.32 17.33,1.37 LOGIC.3 17.18,1.52 16.13,2.57 14.48,2.57 6.08,10.97 v2.18,10.97
  Bottom 0.178: v23.18,21.77 16.58,21.77 v16.28,21.47 | v2.18,10.97 1.58,10.97 0.98,10.37 C12.2
BUTTON  (via drill 0.38)
  Top 0.178: v24.23,12.32 24.23,12.47 22.28,12.47 UC1.37 | 28.58,21.77 26.48,21.77 26.33,21.62 v24.23,21.62 24.23,18.47 25.73,18.47 26.18,18.02 26.18,15.32 23.33,15.32 22.73,15.92 22.28,15.92 UC1.44 | 28.58,21.77 28.58,21.02 BUT.P$4 | 28.58,21.77 29.48,22.67 29.48,24.32 28.73,25.07 BUT.P$2 28.58,25.07 28.58,24.32 26.33,24.32 26.18,24.47 26.18,24.77 25.28,25.67 R48.1
  Route2 0.178: v24.23,21.62 v24.23,12.32
CS  (via drill 0.38)
  Top 0.178: v25.73,10.67 25.73,11.57 24.98,12.32 24.98,13.07 22.28,13.07 UC1.38
  Route15 0.178: v25.73,10.67 21.38,6.32 17.18,6.32 12.38,1.52 LOGIC.5
CUR  (via drill 0.38)
  Top 0.178: v15.08,16.22 15.08,16.07 13.73,16.07 UC1.17
  Route2 0.178: v15.08,16.22 18.08,16.22 v24.23,10.07
  Bottom 0.178: v24.23,10.07 24.38,9.92 28.88,9.92 R20.2 29.03,9.92 29.03,8.72 R21.1
DISC  (via drill 0.38)
  Top 0.178: v23.33,16.22 23.33,16.97 22.28,16.97 UC1.46 | v20.33,5.57 19.28,5.57 19.28,6.32 R28.1 19.13,6.47 17.48,6.47 R50.2
  Route2 0.178: v23.33,16.22 23.33,11.87 24.98,10.22 24.98,9.92 20.63,5.57 v20.33,5.57
ENC_CS  (via drill 0.38)
  Top 0.178: v14.93,9.02 14.93,10.82 15.08,10.97 UC1.25 | v7.88,18.17 8.03,18.32 8.03,21.17 ENCODER.3
  Route2 0.178: v14.93,9.02 14.93,11.12 v7.88,18.17
ENC_MISO  (via drill 0.38)
  Top 0.178: v16.13,7.07 16.13,10.97 UC1.27 | v0.68,6.92 0.98,7.22 0.98,18.02 3.53,20.57 3.53,21.17 ENCODER.6
  Bottom 0.178: v16.13,7.07 15.98,6.92 v0.68,6.92
ENC_MOSI  (via drill 0.38)
  Top 0.178: v16.88,9.92 16.73,10.07 16.73,10.97 UC1.28 | v6.83,18.32 5.18,19.97 5.18,21.17 ENCODER.5
  Route2 0.178: v16.88,9.92 15.38,8.42 15.23,8.42 15.08,8.27 13.58,8.27 11.33,10.52 10.58,10.52 6.83,14.27 v6.83,18.32
ENC_SCK  (via drill 0.38)
  Top 0.178: v15.38,7.67 15.68,7.97 15.68,10.97 UC1.26
  Route15 0.178: v15.38,7.67 9.38,7.67 2.33,14.72 2.33,17.57 5.03,20.27 5.63,20.27 6.53,21.17 ENCODER.4
GND  (via drill 0.38)
  Top 0.178: K1.5 26.03,6.62 26.03,8.72 K1.Z2 | 21.98,6.77 22.28,6.77 22.28,1.52 LOGIC.1 22.43,1.52 26.03,1.52 K1.Z1 | 21.98,6.77 20.78,6.77 20.48,7.07 18.53,7.07 17.48,8.12 R50.1 | v19.28,3.17 19.28,4.37 D4.C | 20.18,15.77 20.18,16.07 21.53,17.42 | 20.18,15.77 20.18,12.47 | 20.18,12.47 20.18,11.12 UC1.35 | 21.53,17.42 22.13,17.42 UC1.47 22.28,17.42 23.48,17.42 24.08,16.82 24.08,16.22 25.13,16.22 R39.2 | 20.18,15.77 17.18,18.77 17.18,19.37 UC1.8 | R48.2 25.13,23.87 24.38,23.12 22.28,23.12 C21.1 22.13,22.97 22.13,22.82 21.38,22.07 21.38,17.57 21.53,17.42 | 25.43,27.32 R22.1 R26.1 28.43,27.32 29.33,28.22 29.33,33.32 23.03,39.62 | 25.43,27.32 R13.1 24.23,27.32 24.23,24.92 25.13,24.02 R48.2 | 25.43,27.32 25.43,31.97 25.88,32.42 HALL.1 | v28.73,23.27 25.28,23.27 25.28,23.87 R48.2 | 21.98,6.77 21.98,10.67 20.18,12.47 | 17.63,39.62 17.63,40.37 R19.1 | 17.63,39.62 17.63,38.57 R18.1 | 23.03,39.62 17.63,39.62 | 23.03,39.62 23.03,40.07 C10.- 23.03,39.62 | 2.93,39.47 2.93,40.37 R15.1 | 2.93,39.47 2.93,38.57 R14.1 | 9.83,39.47 9.83,40.37 R16.1 | 9.83,39.47 9.83,38.42 R17.1 | 9.83,39.47 8.18,39.47 | 8.18,39.47 2.93,39.47 | 8.18,39.47 8.18,46.22 GND.1 | 11.18,28.82 13.88,28.82 14.18,28.52 14.18,25.22 14.48,24.92 C20.1 | 11.18,28.82 11.18,21.17 ENCODER.1 11.03,21.17 11.03,13.07 | 11.03,13.07 10.58,13.07 10.58,13.52 10.28,13.82 | 11.03,13.07 13.58,13.07 UC1.23 | 10.28,13.82 8.33,15.77 C7.1 8.18,16.82 5.78,16.82 5.63,16.67 5.63,15.32 | 10.28,13.82 v10.73,14.27 | 5.63,15.32 5.63,13.07 5.33,12.77 REG1.2 | 5.63,15.32 v4.28,15.32 | 8.18,39.47 10.28,37.37 10.58,37.37 10.58,37.22 11.03,36.77 11.03,33.32 11.18,33.17 11.18,28.82
  Bottom 0.178: 27.68,6.62 26.03,6.62 K1.5 | 27.68,6.62 28.73,6.62 28.88,6.77 R21.2 | DRV3.4 20.33,13.82 20.33,12.62 20.18,12.47 20.18,10.82 21.83,10.82 22.13,10.52 22.13,8.87 26.03,8.87 K1.Z2 | v19.28,3.17 21.23,3.17 22.28,2.12 22.28,1.52 LOGIC.1 | 27.68,6.62 27.68,1.67 26.18,1.67 K1.Z1 | C4.2 28.73,21.32 v28.73,23.27 27.83,23.27 SENSE.5 | C12.1 0.98,12.17 0.98,13.82 1.73,13.82 DRV1.4 1.88,13.97 1.88,15.32 v4.28,15.32 | v10.73,14.27 11.33,14.27 11.63,13.97 DRV2.4
  Bottom 1.016: Q6.3 Q6.2 Q6.1 | Q4.3 Q4.2 Q4.1 | Q2.3 Q2.2 Q2.1
  Bottom 1.676: Q6.1 16.4,40.51 16.4,42.7 14.56,42.73 9,42.7 | 9,42.7 8.24,42.7 8.24,42.61 | GND.2 5.6,42.77 | GND.1 8.04,43.37 | GND.3 2.98,43.37 | Q4.1 9,40.51 9,42.7 | C10.- 20.65,42.73 15.45,42.73
  Bottom 1.7: 15.45,42.73 14.56,42.73
  Bottom 1.778: 8.24,42.61 5.6,42.61 | 5.6,42.61 2.98,42.61 | 2.98,42.61 Q2.2 | 5.6,42.77 5.6,42.61 | 8.04,43.37 8.24,42.7 | 2.98,43.37 2.98,42.61
HALLU  (via drill 0.38)
  Top 0.178: v12.23,20.42 12.23,17.57 13.58,17.57 UC1.14 | HALL.3 22.88,34.37 26.03,34.37 27.23,33.17 27.23,30.17 28.28,29.12 R26.2
  Route2 0.178: v12.23,20.42 12.23,21.77 22.88,32.42 HALL.3
HALLV  (via drill 0.38)
  Top 0.178: v12.98,27.62 12.68,27.32 12.68,21.47 14.48,19.67 14.48,16.97 13.73,16.97 UC1.15 | R22.2 26.78,29.57 26.78,32.72 v25.88,33.62
  Route2 0.178: v12.98,27.62 15.53,27.62 19.58,31.67 20.63,31.67 21.38,32.42 HALL.4
  Bottom 0.178: v25.88,33.62 25.58,33.32 22.13,33.32 21.38,32.57 HALL.4
HALLW  (via drill 0.38)
  Top 0.178: v12.53,16.52 13.58,16.52 UC1.16 | R13.2 20.48,29.12 20.48,31.82 19.88,32.42 HALL.5
  Route15 0.178: v12.53,16.52 12.53,16.82 18.53,22.82 18.53,33.17 19.73,34.37 20.03,34.37 20.63,33.77 20.63,33.32 19.88,32.57 HALL.5
LED  (via drill 0.38)
  Top 0.178: v19.58,9.17 19.58,10.97 UC1.34 | v12.53,8.42 13.73,7.22 13.73,6.32 R36.1
  Bottom 0.178: v19.58,9.17 18.83,8.42 15.23,8.42 15.08,8.27 12.68,8.27 v12.53,8.42
MISO  (via drill 0.38)
  Top 0.178: v24.08,7.67 24.08,9.17 21.38,11.87 21.38,13.97 22.13,13.97 UC1.40
  Bottom 0.178: v24.08,7.67 22.73,6.32 9.53,6.32 4.73,1.52 LOGIC.8
MOSI  (via drill 0.38)
  Top 0.178: v21.08,15.92 21.08,14.57 22.13,14.57 UC1.41
  Route15 0.178: v21.08,15.92 21.53,15.92 25.58,11.87 25.58,11.42 24.98,10.82 23.33,10.82 19.28,6.77 16.73,6.77 12.53,2.57 8.33,2.57 7.28,1.52 LOGIC.7
N$1  (via drill 0.38)
  Top 0.178: v6.08,30.32 6.08,37.52 5.18,38.42 R1.2
  Bottom 0.178: v6.08,30.32 6.08,28.52 5.63,28.52 Q1.4
N$2  (via drill 0.38)
  Top 0.178: v13.73,30.32 13.73,36.47 11.93,38.27 R3.2
  Bottom 0.178: v13.73,30.32 11.93,28.52 Q3.4
N$3  (via drill 0.38)
  Top 0.178: v6.53,40.52 5.18,40.52 R2.2
  Bottom 0.178: v6.53,40.52 5.63,40.52 Q2.4
N$4
  Bottom 0.178: R7.2 5.63,12.17 4.43,13.37 4.43,13.82 DRV1.2
N$5
  Bottom 0.178: D1.1 8.93,15.62 8.93,17.27 C1.1 8.78,17.42 6.83,17.42 5.78,18.47 5.78,18.92 DRV1.8
N$6  (via drill 0.38)
  Top 0.178: v12.98,40.37 11.78,40.37 R4.2
  Bottom 0.178: v12.98,40.37 12.08,40.37 Q4.4
N$7  (via drill 0.38)
  Top 0.178: v19.88,33.62 20.63,34.37 20.63,37.67 19.88,38.42 R5.2
  Route15 0.178: v19.88,33.62 18.98,32.72 18.98,31.67 v19.73,30.92
  Bottom 0.178: v19.73,30.92 19.73,30.47 20.18,30.02 20.18,28.52 Q5.4
N$8
  Bottom 0.178: R8.2 3.83,12.17 3.83,12.77 3.23,13.37 3.23,13.82 DRV1.3
N$9  (via drill 0.38)
  Top 0.178: v20.78,40.52 Q6.4 R6.2
  Bottom 0.178: v20.78,40.52 Q6.4
N$10
  Bottom 0.178: D2.1 17.78,15.62 17.78,17.27 17.33,17.27 C2.1 17.18,17.42 17.03,17.42 15.68,18.77 DRV2.8
N$11  (via drill 0.38)
  Route15 0.178: v9.98,19.97 7.43,19.97 v4.88,17.42
  Bottom 0.178: v9.98,19.97 9.68,19.97 8.93,19.22 C1.2 | v4.88,17.42 4.58,17.72 3.98,17.72 3.23,18.47 3.23,18.92 DRV1.6
N$12
  Bottom 0.178: R9.2 14.63,13.82 14.33,13.82 DRV2.2
N$13
  Bottom 0.178: R10.2 12.83,11.87 12.83,13.82 12.98,13.82 DRV2.3
N$14
  Bottom 0.178: C2.2 17.18,19.22 16.28,20.12 13.88,20.12 13.13,19.37 13.13,18.92 DRV2.6
N$15
  Bottom 0.178: D3.1 26.63,15.62 26.63,16.97 26.48,16.97 C3.1 26.48,17.12 26.48,18.17 27.08,18.17 27.38,18.47 27.38,19.67 24.98,19.67 24.23,18.92 DRV3.8
N$16
  Bottom 0.178: R11.2 23.03,13.82 DRV3.2
N$17
  Bottom 0.178: R12.2 21.08,13.82 21.53,13.82 DRV3.3
N$18
  Bottom 0.178: C3.2 26.33,18.77 25.28,17.72 22.43,17.72 21.68,18.47 21.68,18.77 DRV3.6
N$19  (via drill 0.38)
  Top 0.178: RESET.P$3 28.58,18.92 28.58,14.87 RESET.P$1 28.58,14.72 28.58,11.87 v27.83,11.12 | v26.63,12.77 26.63,12.92 25.28,14.27 R39.1
  Bottom 0.178: v26.63,12.77 26.63,11.12 v27.83,11.12
N$20
  Bottom 0.178: 7.78,22.37 6.23,22.37 6.08,22.47 | 12.58,22.37 12.83,22.37 13.28,22.82 15.08,22.82 15.53,22.37 15.88,22.37
  Bottom 0.6: 1.28,22.47 6.08,22.47 | 7.78,22.37 12.58,22.37 | 15.88,22.37 20.68,22.37
N$22
  Top 0.178: 9.08,12.77 7.73,12.77 REG1.1 | 9.08,12.77 9.83,12.77 D6.1 | 9.08,12.77 9.08,10.07 9.23,9.92 9.23,3.17 1.73,3.17 1.43,3.47 1.43,13.97 2.93,15.47 JP2.2
N$24
  Bottom 0.178: SENSE.7 25.28,22.37 27.83,19.82 27.83,18.92 28.13,18.62 28.88,18.62 28.88,11.87 R20.1
N$26  (via drill 0.38)
  Top 0.178: R49.2 25.28,20.87 26.93,20.87 BUT.P$3 27.08,20.87 27.83,20.12 27.83,18.02 v27.68,17.87 | v27.53,26.27 27.53,25.67 27.08,25.22 BUT.P$1
  Route2 0.178: v27.53,26.27 27.53,18.02 v27.68,17.87
N$27
  Bottom 0.178: C4.1 28.73,19.52 26.63,21.62 26.63,23.27 SENSE.6
N$29
  Top 0.178: R36.2 13.88,4.52 16.13,4.52 D4.A
N$59
  Top 0.178: R29.1 23.03,5.87 22.73,5.57 22.73,3.77 23.48,3.02 26.78,3.02 26.78,4.52 K1.2
N$60
  Top 0.178: R35.1 23.03,7.67 25.43,5.27 25.88,5.27 K1.3
OSC_IN
  Top 0.178: UC1.5 18.68,19.52 18.68,23.57 20.18,25.07 OSC.3 20.33,25.07 20.33,24.92 22.13,24.92 C21.2
OSC_OUT
  Top 0.178: UC1.6 18.08,19.52 18.08,21.32 16.58,22.82 OSC.1 16.43,22.97 14.63,22.97 C20.2
RESET  (via drill 0.38)
  Top 0.178: v20.33,17.42 19.13,17.42 17.63,18.92 17.63,19.37 UC1.7 | v27.38,12.02 27.38,14.42 27.08,14.72 RESET.P$2 26.93,14.87 26.93,18.92 RESET.P$4 26.93,19.07 26.93,19.22 25.28,19.22 R40.2
  Route15 0.178: v20.33,17.42 21.08,17.42 26.48,12.02 v27.38,12.02
SCK  (via drill 0.38)
  Top 0.178: v27.83,7.82 27.83,10.22 25.43,12.62 25.43,13.52 22.28,13.52 UC1.39
  Bottom 0.178: v27.83,7.82 27.38,7.37 24.68,7.37 21.83,4.52 10.88,4.52 9.83,3.47 9.83,1.52 LOGIC.6
U_GATE_HIGH  (via drill 0.38)
  Top 0.178: R1.1 5.03,36.62 2.93,36.62 R14.2 2.78,36.62 2.78,20.72 v2.63,20.57
  Bottom 0.178: v2.63,20.57 2.93,20.27 4.28,20.27 4.28,19.07 DRV1.7
U_GATE_LOW  (via drill 0.38)
  Top 0.178: R2.1 5.03,42.32 2.93,42.32 R15.2 2.78,42.17 2.03,41.42 2.03,21.17 v0.83,19.97
  Bottom 0.178: v0.83,19.97 1.73,19.07 DRV1.5
U_HIGH  (via drill 0.38)
  Top 0.178: v16.58,15.02 16.58,16.22 16.13,16.67 16.13,19.37 UC1.10
  Route15 0.178: v10.13,8.57 v16.58,15.02
  Bottom 0.178: v10.13,8.57 8.93,9.77 6.23,9.77 5.78,10.22 R7.1
U_LOW  (via drill 0.38)
  Top 0.178: v14.33,22.07 15.68,20.72 15.68,19.52 UC1.11
  Route15 0.178: v14.33,22.07 14.33,19.82 6.98,12.47 v6.98,10.97
  Bottom 0.178: v6.98,10.97 6.83,11.12 4.73,11.12 3.98,10.37 R8.1
U_PHASE
  Bottom 0.178: Q1.1 1.73,28.52 2.58,28.97
  Bottom 1.016: Q1.3 Q1.2
  Bottom 1.676: Q1.2 Q1.1 2.52,28.45 | 2.52,35.56 Q2.MB
  Bottom 2: 2.52,35.56 2.52,31.97 X2.1 2.58,31.97 2.58,28.97
USBDM  (via drill 0.38)
  Top 0.178: v18.38,9.77 18.68,10.07 18.68,10.97 UC1.32 | v21.08,2.42 21.68,3.02 21.68,5.57 21.38,5.87 R29.2
  Route2 0.178: v18.38,9.77 18.38,5.12 v21.08,2.42
USBDP
  Top 0.178: UC1.33 19.13,10.97 19.13,9.62 18.83,9.32 18.83,8.57 19.13,8.27 R28.2 19.28,8.12 19.28,7.82 21.08,7.82 R35.2
V+  (via drill 0.38)
  Route15 0.254: v10.73,11.27 11.63,11.27 26.78,26.42 26.78,39.92 26.63,40.07 C10.+
  Bottom 0.254: v10.73,11.27 10.13,11.27 9.68,10.82 JP1.1
  Bottom 1: SENSE.4 SENSE.3
  Bottom 1.7: C10.+ 27.57,40.19 27.82,40.45
  Bottom 2: V+.3 V+.2 V+.1 27.57,45.97 27.82,40.45 SENSE.4
V+_MOS
  Bottom 1: SENSE.1 SENSE.2
  Bottom 1.676: SENSE.1 22.2,28.24 22.2,24.7 18.27,24.7 Q5.MB
  Bottom 1.778: Q1.MB Q3.MB Q5.MB
V_GATE_HIGH  (via drill 0.38)
  Top 0.178: v6.98,36.62 9.68,36.62 R17.2 | v13.13,39.32 11.03,39.32 11.03,37.37 11.78,36.62 R3.1
  Route2 0.178: v10.13,17.72 9.23,17.72 7.13,19.82 2.48,19.82 1.88,20.42 1.88,31.52 v6.98,36.62
  Bottom 0.178: v6.98,36.62 6.98,39.32 v13.13,39.32 | v10.13,17.72 14.18,17.72 14.18,18.77 DRV2.7
V_GATE_LOW  (via drill 0.38)
  Top 0.178: R16.2 9.98,42.32 11.63,42.32 R4.1 11.78,42.17 12.08,42.17 14.18,40.07 14.18,30.92 v14.78,30.32
  Route15 0.178: v10.28,18.92 11.63,18.92 12.98,20.27 12.98,21.17 12.23,21.92 12.23,27.77 v14.78,30.32
  Bottom 0.178: v10.28,18.92 11.63,18.92 DRV2.5
V_HIGH  (via drill 0.38)
  Top 0.178: v16.88,12.02 16.88,12.17 15.83,13.22 15.83,16.37 15.23,16.97 15.23,19.37 UC1.12
  Route15 0.178: v13.88,9.02 v16.88,12.02
  Bottom 0.178: v13.88,9.02 14.78,9.92 R9.1
V_LOW  (via drill 0.38)
  Top 0.178: v13.43,26.27 13.73,26.57 13.73,28.37 12.83,28.37 12.23,27.77 12.23,21.32 12.98,20.57 12.98,18.62 13.58,18.02 UC1.13
  Route15 0.178: v13.43,26.27 13.43,23.87 15.08,22.22 15.08,19.97 9.98,14.87 9.98,9.92 v10.28,9.62
  Bottom 0.178: v10.28,9.62 10.58,9.92 12.68,9.92 R10.1
V_PHASE
  Bottom 1.016: Q3.2 10.08,28.45 Q3.3
  Bottom 1.676: Q4.MB 11.88,35.59 10.13,35.59 | Q3.2 Q3.1
  Bottom 2: 10.13,35.59 10.08,35.59 X2.2 10.08,28.45
VCC  (via drill 0.38)
  Top 0.178: D5.1 20.93,4.22 20.03,3.32 20.03,1.67 19.88,1.52 LOGIC.2 | JP2.1 3.08,16.52 5.18,16.52 5.18,16.82 5.78,17.42 9.23,17.42 9.23,20.87 9.53,21.17 ENCODER.2
  Route2 0.178: v28.73,26.27 28.73,28.07 24.98,31.82 | 24.98,31.82 24.38,32.42 HALL.2 | 11.03,17.87 11.03,19.82 9.68,21.17 ENCODER.2 | 11.03,17.87 11.03,16.22 15.68,11.57 16.13,11.57 17.63,10.07 17.63,3.92 19.73,1.82 19.73,1.52 LOGIC.2 | 11.03,17.87 24.98,31.82
  Bottom 0.178: v28.73,26.27 27.98,25.52 24.08,25.52 24.08,23.42 SENSE.8
VDRIVER  (via drill 0.38)
  Top 0.254: v11.48,12.17 11.48,4.82 14.78,1.52 LOGIC.4
  Bottom 0.254: D3.3 27.53,13.52 26.78,14.27 24.53,14.27 24.23,13.97 DRV3.1 24.38,14.27 23.48,15.17 19.88,15.17 18.53,13.82 D2.3 18.68,13.52 17.93,14.27 15.98,14.27 15.68,13.97 DRV2.1 15.83,14.27 14.93,15.17 10.58,15.17 9.98,14.57 9.98,13.52 D1.3 | 8.26,11.79 8.18,11.72 8.18,10.82 8.78,10.82 JP1.2 | 8.26,11.79 9.83,13.37 D1.3 | DRV1.1 5.78,13.82 7.73,11.87 8.18,11.87 8.26,11.79 | v11.48,12.17 10.28,13.37 9.98,13.37 D1.3
VUSB  (via drill 0.38)
  Top 0.178: D6.2 11.03,10.52 v11.03,3.77 | D5.2 23.33,4.22 25.88,4.22 25.88,3.92 K1.1
  Bottom 0.178: v11.03,3.77 11.18,3.92 25.88,3.92 K1.1
W_GATE_HIGH  (via drill 0.38)
  Top 0.178: 18.98,36.77 19.73,36.77 R5.1 | 18.98,36.77 17.63,36.77 R18.2 | v19.43,29.87 18.98,30.32 18.98,36.77
  Route15 0.178: v20.33,21.02 20.33,28.97 v19.43,29.87
  Bottom 0.178: v20.33,21.02 22.88,21.02 22.88,18.92 DRV3.7
W_GATE_LOW  (via drill 0.38)
  Top 0.178: R6.1 19.43,42.32 17.63,42.32 R19.2 17.48,42.17 16.58,41.27 16.58,36.32 17.78,35.12 17.78,24.17 14.18,24.17 13.58,23.57 v13.58,21.47
  Bottom 0.178: v13.58,21.47 14.33,20.72 18.53,20.72 20.33,18.92 DRV3.5
W_HIGH  (via drill 0.38)
  Top 0.178: v15.83,12.32 15.38,12.77 15.38,15.47 13.73,15.47 UC1.18
  Route15 0.178: v15.83,12.32 16.28,12.32 16.73,12.77 22.88,12.77 24.08,11.57 v24.83,11.57
  Bottom 0.178: v24.83,11.57 23.33,10.07 R11.1
W_LOW  (via drill 0.38)
  Top 0.178: v13.73,10.97 14.48,11.72 14.48,14.87 13.73,14.87 UC1.19
  Bottom 0.178: v13.73,10.97 13.88,10.82 19.58,10.82 20.33,10.07 20.93,10.07 R12.1
W_PHASE
  Bottom 0.178: Q6.MB 17.63,36.92 17.78,36.17
  Bottom 1.016: Q5.3 17.75,28.45 | Q5.2 Q5.1
  Bottom 1.676: Q5.2 17.75,28.45 | Q6.MB 17.75,36.86
  Bottom 2: X2.3 17.78,31.97 | 17.78,31.97 17.78,36.17 | Q5.1 17.78,28.45 17.78,31.97

### Text on the board
tNames: "MAY THE FORCE | BE WITH US" | -------------------------- | RHOBAN BLDC REV1
bNames: GND | V+ | GND | MISO | MOSI | SCK | CS | VDRIVER | 3.3 | VCC